# Altium project STM32F7 Dev.PrjPcb (part 2 of 2)

## Sheet Sheet3.SchDoc
size Legal
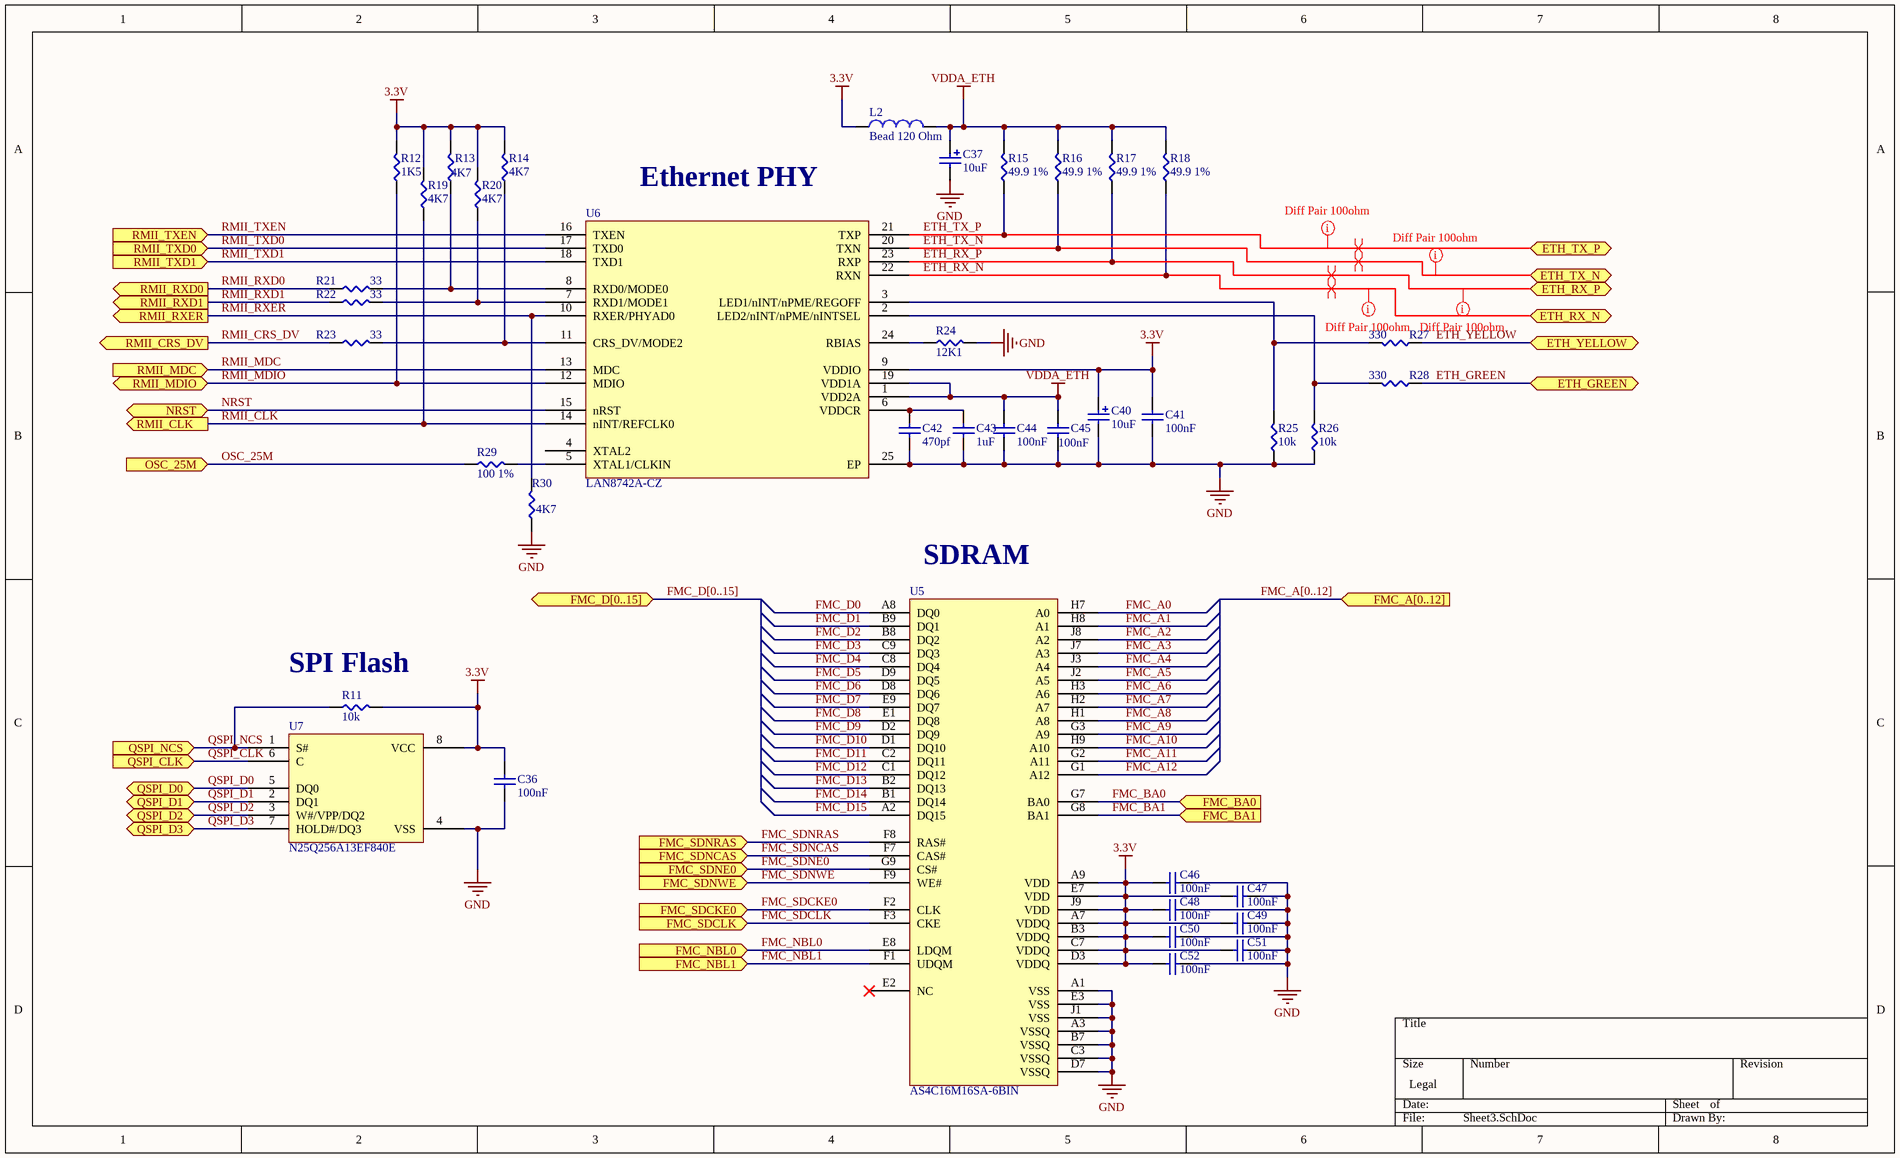
[diagram p2: Sheet3.SchDoc]

### Parts
C36  100nF  [CAP0402X04M]
C37  10uF  [CAPPOL1206X07M]
C40  10uF  [CAPPOL1206X07M]
C41  100nF  [CAP0402X04M]
C42  470pf  [CAP0402X04M]
C43  1uF  [CAP0402X04M]
C44  100nF  [CAP0402X04M]
C45  100nF  [CAP0402X04M]
C46  100nF  [CAP0402X04M]
C47  100nF  [CAP0402X04M]
C48  100nF  [CAP0402X04ROUND]
C49  100nF  [CAP0402X04ROUND]
C50  100nF  [CAP0402X04ROUND]
C51  100nF  [CAP0402X04ROUND]
C52  100nF  [CAP0402X04ROUND]
L2  Bead 120 Ohm  [IND0603X055M]
R11  10k  [RES0402X04M]
R12  1K5  [RES0402X04M]
R13  4K7  [RES0402X04M]
R14  4K7  [RES0402X04M]
R15  49.9 1%  [RES0402X04M]
R16  49.9 1%  [RES0402X04M]
R17  49.9 1%  [RES0402X04M]
R18  49.9 1%  [RES0402X04M]
R19  4K7  [RES0402X04M]
R20  4K7  [RES0402X04M]
R21  33  [RES0402X04M]
R22  33  [RES0402X04M]
R23  33  [RES0402X04M]
R24  12K1  [RES0402X04M]
R25  10k  [RES0402X04M]
R26  10k  [RES0402X04M]
R27  330  [RES0402X04M]
R28  330  [RES0402X04M]
R29  100 1%  [RES0402X04M]
R30  4K7  [RES0402X04M]
U5  AS4C16M16SA-6BIN  [BGA100P9X9-54A]
U6  LAN8742A-CZ  [QFN50P400X400X100_HS-25N]
U7  N25Q256A13EF840E  [SON127P800X100_HS-9N]

### Ports
ETH_GREEN (bidir), ETH_RX_N (bidir), ETH_RX_P (bidir), ETH_TX_N (bidir), ETH_TX_P (bidir), ETH_YELLOW (bidir), FMC_A[0..12] (in), FMC_BA0 (in), FMC_BA1 (in), FMC_D[0..15] (bidir), FMC_NBL0 (in), FMC_NBL1 (in), FMC_SDCKE0 (in), FMC_SDCLK (in), FMC_SDNCAS (in), FMC_SDNE0 (in), FMC_SDNRAS (in), FMC_SDNWE (in), NRST (bidir), OSC_25M (in), QSPI_CLK (in), QSPI_D0 (bidir), QSPI_D1 (bidir), QSPI_D2 (bidir), QSPI_D3 (bidir), QSPI_NCS (in), RMII_CLK (out), RMII_CRS_DV (out), RMII_MDC (in), RMII_MDIO (bidir), RMII_RXD0 (out), RMII_RXD1 (out), RMII_RXER (out), RMII_TXD0 (in), RMII_TXD1 (in), RMII_TXEN (in)

### Nets
3.3V: C36.2 C40.1 C41.2 C46.1 C47.1 C48.1 C49.1 C50.1 C51.1 C52.1 L2.1 R11.2 R12.2 R13.2 R14.2 R19.2 R20.2 U5.A7(VDDQ) U5.A9(VDD) U5.B3(VDDQ) U5.C7(VDDQ) U5.D3(VDDQ) U5.E7(VDD) U5.J9(VDD) U6.9(VDDIO) U7.8(VCC)
GND: C36.1 C37.2 C40.2 C41.1 C42.1 C43.1 C44.1 C45.1 C46.2 C47.2 C48.2 C49.2 C50.2 C51.2 C52.2 R24.2 R25.1 R26.1 R30.1 U5.A1(VSS) U5.A3(VSSQ) U5.B7(VSSQ) U5.C3(VSSQ) U5.D7(VSSQ) U5.E3(VSS) U5.J1(VSS) U6.25(EP) U7.4(VSS)
VDDA_ETH: C37.1 C44.2 C45.2 L2.2 R15.2 R16.2 R17.2 R18.2 U6.1(VDD2A) U6.19(VDD1A)
ETH_GREEN: R28.1 ; port ETH_GREEN
ETH_RX_N: R18.1 U6.22(RXN) ; port ETH_RX_N
ETH_RX_P: R17.1 U6.23(RXP) ; port ETH_RX_P
ETH_TX_N: R16.1 U6.20(TXN) ; port ETH_TX_N
ETH_TX_P: R15.1 U6.21(TXP) ; port ETH_TX_P
ETH_YELLOW: R27.1 ; port ETH_YELLOW
FMC_A0: U5.H7(A0)
FMC_A1: U5.H8(A1)
FMC_A2: U5.J8(A2)
FMC_A3: U5.J7(A3)
FMC_A4: U5.J3(A4)
FMC_A5: U5.J2(A5)
FMC_A6: U5.H3(A6)
FMC_A7: U5.H2(A7)
FMC_A8: U5.H1(A8)
FMC_A9: U5.G3(A9)
FMC_A10: U5.H9(A10)
FMC_A11: U5.G2(A11)
FMC_A12: U5.G1(A12)
FMC_BA0: U5.G7(BA0) ; port FMC_BA0
FMC_BA1: U5.G8(BA1) ; port FMC_BA1
FMC_D0: U5.A8(DQ0)
FMC_D1: U5.B9(DQ1)
FMC_D2: U5.B8(DQ2)
FMC_D3: U5.C9(DQ3)
FMC_D4: U5.C8(DQ4)
FMC_D5: U5.D9(DQ5)
FMC_D6: U5.D8(DQ6)
FMC_D7: U5.E9(DQ7)
FMC_D8: U5.E1(DQ8)
FMC_D9: U5.D2(DQ9)
FMC_D10: U5.D1(DQ10)
FMC_D11: U5.C2(DQ11)
FMC_D12: U5.C1(DQ12)
FMC_D13: U5.B2(DQ13)
FMC_D14: U5.B1(DQ14)
FMC_D15: U5.A2(DQ15)
FMC_NBL0: U5.E8(LDQM) ; port FMC_NBL0
FMC_NBL1: U5.F1(UDQM) ; port FMC_NBL1
FMC_SDCKE0: U5.F2(CLK) ; port FMC_SDCKE0
FMC_SDCLK: U5.F3(CKE) ; port FMC_SDCLK
FMC_SDNCAS: U5.F7(CAS#) ; port FMC_SDNCAS
FMC_SDNE0: U5.G9(CS#) ; port FMC_SDNE0
FMC_SDNRAS: U5.F8(RAS#) ; port FMC_SDNRAS
FMC_SDNWE: U5.F9(WE#) ; port FMC_SDNWE
NRST: U6.15(nRST) ; port NRST
OSC_25M: R29.1 ; port OSC_25M
QSPI_CLK: U7.6(C) ; port QSPI_CLK
QSPI_D0: U7.5(DQ0) ; port QSPI_D0
QSPI_D1: U7.2(DQ1) ; port QSPI_D1
QSPI_D2: U7.3(W#/VPP/DQ2) ; port QSPI_D2
QSPI_D3: U7.7(HOLD#/DQ3) ; port QSPI_D3
QSPI_NCS: R11.1 U7.1(S#) ; port QSPI_NCS
RMII_CLK: R19.1 U6.14(nINT/REFCLK0) ; port RMII_CLK
RMII_CRS_DV: R23.1 ; port RMII_CRS_DV
RMII_MDC: U6.13(MDC) ; port RMII_MDC
RMII_MDIO: R12.1 U6.12(MDIO) ; port RMII_MDIO
RMII_RXD0: R21.1 ; port RMII_RXD0
RMII_RXD1: R22.1 ; port RMII_RXD1
RMII_RXER: R30.2 U6.10(RXER/PHYAD0) ; port RMII_RXER
RMII_TXD0: U6.17(TXD0) ; port RMII_TXD0
RMII_TXD1: U6.18(TXD1) ; port RMII_TXD1
RMII_TXEN: U6.16(TXEN) ; port RMII_TXEN
NetC42_2: C42.2 C43.2 U6.6(VDDCR)
NetR13_1: R13.1 R21.2 U6.8(RXD0/MODE0)
NetR14_1: R14.1 R23.2 U6.11(CRS_DV/MODE2)
NetR20_1: R20.1 R22.2 U6.7(RXD1/MODE1)
NetR24_1: R24.1 U6.24(RBIAS)
NetR25_2: R25.2 R27.2 U6.3(LED1/nINT/nPME/REGOFF)
NetR26_2: R26.2 R28.2 U6.2(LED2/nINT/nPME/nINTSEL)
NetR29_2: R29.2 U6.5(XTAL1/CLKIN)

Not connected (* = marked no-connect by the designer): U5 E2(NC)*; U6 4(XTAL2)

### Buses and harness runs
bus FMC_A[0..12] = port FMC_A[0..12]
bus FMC_D[0..15] = port FMC_D[0..15]

### Layout directives
differential pair: ETH_RX_N, ETH_RX_P, ETH_TX_N, ETH_TX_P
DiffPair100: Undefined: ETH_RX_N, ETH_RX_P, ETH_TX_N, ETH_TX_P

### Notes on the sheet
- (near U6) Ethernet PHY
- (near U5) SDRAM
- (near R11) SPI Flash

### Library data of the parts
C36 C41 C44-C52 = GRM155R71C104KA88J: CAP CER 0.1UF 16V X7R 0402; Manufacturer: Murata Electronics North America; Capacitance: 0.10µF; Tolerance: ±10%; Supplier 1: Digi-Key; Manufacturer Part Number: GRM155R71C104KA88J; RoHS: RoHS Compliant; Category: Capacitors; Stock 1: 28696221; Pricing 1: 1=0.1, 10=0.012, 50=0.0066, 100=0.0055, 250=0.00452, 500=0.00386, 1000=0.003, 5000=0.0025, 10000=0.0023 (USD); Packaging: Cut Tape (CT); Part Status: Active; Voltage - Rated: 16V; Temperature Coefficient: X7R; Operating Temperature: -55°C ~ 125°C; Features: -; Ratings: -; Applications: General Purpose; Failure Rate: *; Mounting Type: Surface Mount, MLCC; Package / Case: 0402 (1005 Metric); Size / Dimension: 0.039" L x 0.020" W (1.00mm x 0.50mm); Height - Seated (Max): -; Thickness (Max): 0.022" (0.55mm); Lead Spacing: -; Lead Style: *; ComponentLink1URL: http://www.murata.com/~/media/webrenewal/support/library/catalog/products/capacitor/mlcc/c02e.pdf; ComponentLink1Description: http://www.murata.com/~/media/webrenewal/support/library/catalog/products/capacitor/mlcc/c02e.pdf; Supplier Part Number 1: 490-6328-1-ND
C37 C40 = 293D106X9010A2TE3: CAP TANT 10UF 10V 10% 1206; Manufacturer: Vishay Sprague; Manufacturer Size Code: A; Capacitance: 10µF; Type: Molded; ESR (Equivalent Series Resistance): 3.4 Ohm; Supplier 1: Digi-Key; Manufacturer Part Number: 293D106X9010A2TE3; RoHS: RoHS Compliant; Category: Capacitors; Stock 1: 36334; Pricing 1: 1=0.44, 10=0.314, 25=0.268, 50=0.2374, 100=0.2068, 250=0.1762, 500=0.15322, 1000=0.13024 (USD); Packaging: Cut Tape (CT); Part Status: Active; Tolerance: ±10%; Voltage - Rated: 10V; Operating Temperature: -55°C ~ 125°C; Lifetime @ Temp.: -; Mounting Type: Surface Mount; Package / Case: 1206 (3216 Metric); Size / Dimension: 0.126" L x 0.063" W (3.20mm x 1.60mm); Height - Seated (Max): 0.071" (1.80mm); Lead Spacing: -; Features: General Purpose; Failure Rate: -; ComponentLink1URL: http://www.vishay.com/docs/40002/293d.pdf; ComponentLink1Description: http://www.vishay.com/docs/40002/293d.pdf; Supplier Part Number 1: 718-1121-1-ND
C42 = CL05B471KB5NNNC: CAP CER 470PF 50V X7R 0402; Manufacturer: Samsung Electro-Mechanics America, Inc.; Tolerance: ±10%; Supplier 1: Digi-Key; Manufacturer Part Number: CL05B471KB5NNNC; RoHS: RoHS Compliant; Category: Capacitors; Stock 1: 310584; Pricing 1: 1=0.1, 10=0.01, 25=0.006, 50=0.0044, 100=0.0036, 250=0.00304, 500=0.0026, 1000=0.00204, 5000=0.0017 (USD); Packaging: Cut Tape (CT); Part Status: Active; Capacitance: 470pF; Voltage - Rated: 50V; Temperature Coefficient: X7R; Operating Temperature: -55°C ~ 125°C; Features: -; Ratings: -; Applications: General Purpose; Mounting Type: Surface Mount, MLCC; Package / Case: 0402 (1005 Metric); Size / Dimension: 0.039" L x 0.020" W (1.00mm x 0.50mm); Height - Seated (Max): -; Thickness (Max): 0.022" (0.55mm); Lead Spacing: -; Lead Style: -; ComponentLink1URL: http://www.samsungsem.com/kr/support/product-search/mlcc/__icsFiles/afieldfile/2016/08/18/S_CL05B471KB5NNNC.pdf; ComponentLink1Description: http://www.samsungsem.com/kr/support/product-search/mlcc/__icsFiles/afieldfile/2016/08/18/S_CL05B471KB5NNNC.pdf; Supplier Part Number 1: 1276-1566-1-ND
C43 = GRM155R60J105KE19D: CAP CER 1UF 6.3V X5R 0402; Manufacturer: Murata Electronics North America; Capacitance: 1µF; Tolerance: ±10%; Supplier 1: Digi-Key; Manufacturer Part Number: GRM155R60J105KE19D; RoHS: RoHS Compliant; Category: Capacitors; Stock 1: 3970482; Pricing 1: 1=0.1, 10=0.021, 50=0.0114, 100=0.0096, 250=0.00784, 500=0.0067, 1000=0.00522, 5000=0.00435 (USD); Packaging: Cut Tape (CT); Part Status: Active; Voltage - Rated: 6.3V; Temperature Coefficient: X5R; Operating Temperature: -55°C ~ 85°C; Features: -; Ratings: -; Applications: General Purpose; Failure Rate: *; Mounting Type: Surface Mount, MLCC; Package / Case: 0402 (1005 Metric); Size / Dimension: 0.039" L x 0.020" W (1.00mm x 0.50mm); Height - Seated (Max): -; Thickness (Max): 0.022" (0.55mm); Lead Spacing: -; Lead Style: -; ComponentLink1URL: http://www.murata.com/~/media/webrenewal/support/library/catalog/products/capacitor/mlcc/c02e.pdf; ComponentLink1Description: http://www.murata.com/~/media/webrenewal/support/library/catalog/products/capacitor/mlcc/c02e.pdf; Supplier Part Number 1: 490-1320-1-ND
L2 = BLM18PG121SN1D: FERRITE BEAD 120 OHM 0603 1LN; Manufacturer: Murata Electronics North America; Filter Type: Power Line; Number of Lines: 1; Impedance @ Frequency: 120 Ohm @ 100MHz; Current Rating (Max): 2A; DC Resistance (DCR) (Max): 50 mOhm; Supplier 1: Digi-Key; Manufacturer Part Number: BLM18PG121SN1D; RoHS: RoHS Compliant; Category: Filters; Stock 1: 815704; Pricing 1: 1=0.1, 10=0.083, 50=0.0684, 100=0.0501, 250=0.03644, 500=0.0334, 1000=0.02884 (USD); Packaging: Cut Tape (CT); Part Status: Active; Ratings: -; Operating Temperature: -55°C ~ 125°C; Package / Case: 0603 (1608 Metric); Mounting Type: Surface Mount; Height (Max): 0.037" (0.95mm); Size / Dimension: 0.063" L x 0.031" W (1.60mm x 0.80mm); ComponentLink1URL: http://search.murata.co.jp/Ceramy/image/img/PDF/ENG/L0110S0100BLM18P.pdf; ComponentLink1Description: http://search.murata.co.jp/Ceramy/image/img/PDF/ENG/L0110S0100BLM18P.pdf; Supplier Part Number 1: 490-1037-1-ND
R11 R25 R26 = RC0402FR-0710KL: RES SMD 10K OHM 1% 1/16W 0402; Manufacturer: Yageo; Power (Watts): 0.063W, 1/16W; Temperature Coefficient: ±100ppm/°C; Supplier 1: Digi-Key; Manufacturer Part Number: RC0402FR-0710KL; RoHS: RoHS Compliant; Category: Resistors; Stock 1: 13115833; Pricing 1: 1=0.1, 10=0.013, 25=0.0096, 100=0.0054, 250=0.00412, 500=0.00328, 1000=0.00242, 2500=0.0021, 5000=0.00173 (USD); Packaging: Cut Tape (CT); Part Status: Active; Resistance (Ohms): 10k; Tolerance: ±1%; Composition: Thick Film; Features: Moisture Resistant; Operating Temperature: -55°C ~ 155°C; Package / Case: 0402 (1005 Metric); Supplier Device Package: 0402; Size / Dimension: 0.039" L x 0.020" W (1.00mm x 0.50mm); Height - Seated (Max): 0.016" (0.40mm); Number of Terminations: 2; Failure Rate: -; ComponentLink1URL: http://www.yageo.com/NewPortal/yageodocoutput?fileName=/pdf/R-Chip/PYu-RC_Group_51_RoHS_L_4.pdf; ComponentLink1Description: http://www.yageo.com/NewPortal/yageodocoutput?fileName=/pdf/R-Chip/PYu-RC_Group_51_RoHS_L_4.pdf; Supplier Part Number 1: 311-10.0KLRCT-ND
R12 = ERJ-2RKF1501X: RES SMD 1.5K OHM 1% 1/10W 0402; Manufacturer: Panasonic Electronic Components; Power (Watts): 0.1W, 1/10W; Temperature Coefficient: ±100ppm/°C; Supplier 1: Digi-Key; Manufacturer Part Number: ERJ-2RKF1501X; RoHS: RoHS Compliant; Category: Resistors; Stock 1: 495191; Pricing 1: 1=0.1, 50=0.015, 100=0.011, 250=0.0084, 500=0.00674, 1000=0.00496, 5000=0.00355 (USD); Packaging: Cut Tape (CT); Part Status: Active; Resistance (Ohms): 1.5k; Tolerance: ±1%; Composition: Thick Film; Features: Automotive AEC-Q200; Operating Temperature: -55°C ~ 155°C; Package / Case: 0402 (1005 Metric); Supplier Device Package: 0402; Size / Dimension: 0.039" L x 0.020" W (1.00mm x 0.50mm); Height - Seated (Max): 0.016" (0.40mm); Number of Terminations: 2; Failure Rate: -; ComponentLink1URL: http://industrial.panasonic.com/www-cgi/jvcr13pz.cgi?E+PZ+3+AOA0002+ERJ2RKF1501X+7+WW; ComponentLink1Description: http://industrial.panasonic.com/www-cgi/jvcr13pz.cgi?E+PZ+3+AOA0002+ERJ2RKF1501X+7+WW; Supplier Part Number 1: P1.50KLCT-ND
R13 R14 R19 R20 R30 = ERJ-2RKF4701X: RES SMD 4.7K OHM 1% 1/10W 0402; Manufacturer: Panasonic Electronic Components; Power (Watts): 0.1W, 1/10W; Temperature Coefficient: ±100ppm/°C; Supplier 1: Digi-Key; Manufacturer Part Number: ERJ-2RKF4701X; RoHS: RoHS Compliant; Category: Resistors; Stock 1: 2071334; Pricing 1: 1=0.1, 50=0.015, 100=0.011, 250=0.0084, 500=0.00674, 1000=0.00496, 5000=0.00355 (USD); Packaging: Cut Tape (CT); Part Status: Active; Resistance (Ohms): 4.7k; Tolerance: ±1%; Composition: Thick Film; Features: Automotive AEC-Q200; Operating Temperature: -55°C ~ 155°C; Package / Case: 0402 (1005 Metric); Supplier Device Package: 0402; Size / Dimension: 0.039" L x 0.020" W (1.00mm x 0.50mm); Height - Seated (Max): 0.016" (0.40mm); Number of Terminations: 2; Failure Rate: -; ComponentLink1URL: http://industrial.panasonic.com/www-cgi/jvcr13pz.cgi?E+PZ+3+AOA0002+ERJ2RKF4701X+7+WW; ComponentLink1Description: http://industrial.panasonic.com/www-cgi/jvcr13pz.cgi?E+PZ+3+AOA0002+ERJ2RKF4701X+7+WW; Supplier Part Number 1: P4.70KLCT-ND
R15-R18 = RC0402FR-0749R9L: RES SMD 49.9 OHM 1% 1/16W 0402; Manufacturer: Yageo; Resistance (Ohms): 49.9; Power (Watts): 0.063W, 1/16W; Temperature Coefficient: ±100ppm/°C; Supplier 1: Digi-Key; Manufacturer Part Number: RC0402FR-0749R9L; RoHS: RoHS Compliant; Category: Resistors; Stock 1: 3988356; Pricing 1: 1=0.1, 10=0.012, 25=0.0088, 50=0.0066, 100=0.0049, 250=0.00372, 500=0.00298, 1000=0.0022, 5000=0.00158 (USD); Packaging: Cut Tape (CT); Part Status: Active; Tolerance: ±1%; Composition: Thick Film; Features: Moisture Resistant; Operating Temperature: -55°C ~ 155°C; Package / Case: 0402 (1005 Metric); Supplier Device Package: 0402; Size / Dimension: 0.039" L x 0.020" W (1.00mm x 0.50mm); Height - Seated (Max): 0.016" (0.40mm); Number of Terminations: 2; Failure Rate: -; ComponentLink1URL: http://www.yageo.com/NewPortal/yageodocoutput?fileName=/pdf/R-Chip/PYu-RC_Group_51_RoHS_L_4.pdf; ComponentLink1Description: http://www.yageo.com/NewPortal/yageodocoutput?fileName=/pdf/R-Chip/PYu-RC_Group_51_RoHS_L_4.pdf; Supplier Part Number 1: 311-49.9LRCT-ND
R21-R23 = ERJ-2RKF33R0X: RES SMD 33 OHM 1% 1/10W 0402; Manufacturer: Panasonic Electronic Components; Power (Watts): 0.1W, 1/10W; Temperature Coefficient: ±100ppm/°C; Supplier 1: Digi-Key; Manufacturer Part Number: ERJ-2RKF33R0X; RoHS: RoHS Compliant; Category: Resistors; Stock 1: 551621; Pricing 1: 1=0.1, 50=0.015, 100=0.011, 250=0.0084, 500=0.00674, 1000=0.00496, 5000=0.00355 (USD); Packaging: Cut Tape (CT); Part Status: Active; Resistance (Ohms): 33; Tolerance: ±1%; Composition: Thick Film; Features: Automotive AEC-Q200; Operating Temperature: -55°C ~ 155°C; Package / Case: 0402 (1005 Metric); Supplier Device Package: 0402; Size / Dimension: 0.039" L x 0.020" W (1.00mm x 0.50mm); Height - Seated (Max): 0.016" (0.40mm); Number of Terminations: 2; Failure Rate: -; ComponentLink1URL: http://industrial.panasonic.com/www-cgi/jvcr13pz.cgi?E+PZ+3+AOA0002+ERJ2RKF33R0X+7+WW; ComponentLink1Description: http://industrial.panasonic.com/www-cgi/jvcr13pz.cgi?E+PZ+3+AOA0002+ERJ2RKF33R0X+7+WW; Supplier Part Number 1: P33.0LCT-ND
R24 = ERJ-2RKF1212X: RES SMD 12.1K OHM 1% 1/10W 0402; Manufacturer: Panasonic Electronic Components; Power (Watts): 0.1W, 1/10W; Temperature Coefficient: ±100ppm/°C; Supplier 1: Digi-Key; Manufacturer Part Number: ERJ-2RKF1212X; RoHS: RoHS Compliant; Category: Resistors; Stock 1: 177460; Pricing 1: 1=0.1, 50=0.015, 100=0.011, 250=0.0084, 500=0.00674, 1000=0.00496, 5000=0.00355 (USD); Packaging: Cut Tape (CT); Part Status: Active; Resistance (Ohms): 12.1k; Tolerance: ±1%; Composition: Thick Film; Features: Automotive AEC-Q200; Operating Temperature: -55°C ~ 155°C; Package / Case: 0402 (1005 Metric); Supplier Device Package: 0402; Size / Dimension: 0.039" L x 0.020" W (1.00mm x 0.50mm); Height - Seated (Max): 0.016" (0.40mm); Number of Terminations: 2; Failure Rate: -; ComponentLink1URL: http://industrial.panasonic.com/www-cgi/jvcr13pz.cgi?E+PZ+3+AOA0002+ERJ2RKF1212X+7+WW; ComponentLink1Description: http://industrial.panasonic.com/www-cgi/jvcr13pz.cgi?E+PZ+3+AOA0002+ERJ2RKF1212X+7+WW; Supplier Part Number 1: P12.1KLCT-ND
R27 R28 = ERJ-2RKF3300X: RES SMD 330 OHM 1% 1/10W 0402; Manufacturer: Panasonic Electronic Components; Power (Watts): 0.1W, 1/10W; Temperature Coefficient: ±100ppm/°C; Supplier 1: Digi-Key; Manufacturer Part Number: ERJ-2RKF3300X; RoHS: RoHS Compliant; Category: Resistors; Stock 1: 549213; Pricing 1: 1=0.1, 50=0.015, 100=0.011, 250=0.0084, 500=0.00674, 1000=0.00496, 5000=0.00355 (USD); Packaging: Cut Tape (CT); Part Status: Active; Resistance (Ohms): 330; Tolerance: ±1%; Composition: Thick Film; Features: Automotive AEC-Q200; Operating Temperature: -55°C ~ 155°C; Package / Case: 0402 (1005 Metric); Supplier Device Package: 0402; Size / Dimension: 0.039" L x 0.020" W (1.00mm x 0.50mm); Height - Seated (Max): 0.016" (0.40mm); Number of Terminations: 2; Failure Rate: -; ComponentLink1URL: http://industrial.panasonic.com/www-cgi/jvcr13pz.cgi?E+PZ+3+AOA0002+ERJ2RKF3300X+7+WW; ComponentLink1Description: http://industrial.panasonic.com/www-cgi/jvcr13pz.cgi?E+PZ+3+AOA0002+ERJ2RKF3300X+7+WW; Supplier Part Number 1: P330LCT-ND
R29 = RC0402FR-07100RL: RES SMD 100 OHM 1% 1/16W 0402; Manufacturer: Yageo; Resistance (Ohms): 100; Power (Watts): 0.063W, 1/16W; Temperature Coefficient: ±100ppm/°C; Supplier 1: Digi-Key; Manufacturer Part Number: RC0402FR-07100RL; RoHS: RoHS Compliant; Category: Resistors; Stock 1: 4498031; Pricing 1: 1=0.1, 10=0.013, 25=0.0096, 100=0.0054, 250=0.00412, 500=0.00328, 1000=0.00242, 2500=0.0021, 5000=0.00173 (USD); Packaging: Cut Tape (CT); Part Status: Active; Tolerance: ±1%; Composition: Thick Film; Features: Moisture Resistant; Operating Temperature: -55°C ~ 155°C; Package / Case: 0402 (1005 Metric); Supplier Device Package: 0402; Size / Dimension: 0.039" L x 0.020" W (1.00mm x 0.50mm); Height - Seated (Max): 0.016" (0.40mm); Number of Terminations: 2; Failure Rate: -; ComponentLink1URL: http://www.yageo.com/NewPortal/yageodocoutput?fileName=/pdf/R-Chip/PYu-RC_Group_51_RoHS_L_4.pdf; ComponentLink1Description: http://www.yageo.com/NewPortal/yageodocoutput?fileName=/pdf/R-Chip/PYu-RC_Group_51_RoHS_L_4.pdf; Supplier Part Number 1: 311-100LRCT-ND
U5 = AS4C16M16SA-6BIN: IC SDRAM 256MBIT 166MHZ 54BGA; Manufacturer: Alliance Memory, Inc.; Format - Memory: RAM; Memory Type: SDRAM (Synchronous DRAM); Memory Size: 256M (16M x 16); Interface: Parallel; Voltage - Supply: 3 V ~ 3.6 V; Supplier 1: Digi-Key; Manufacturer Part Number: AS4C16M16SA-6BIN; RoHS: RoHS Compliant; Category: Integrated Circuits (ICs); Stock 1: 1203; Pricing 1: 1=4.87, 10=4.423, 25=4.3272, 50=4.3032, 100=3.8592, 250=3.8448 (USD); Packaging: Tray; Part Status: Active; Speed: 166MHz; Operating Temperature: -40°C ~ 85°C (TA); Package / Case: 54-TFBGA; Supplier Device Package: 54-TFBGA (8x8); ComponentLink1URL: http://www.alliancememory.com/pdf/dram/256Mb-AS4C16M16SA-C&I_V3.0_March%202015.pdf; ComponentLink1Description: http://www.alliancememory.com/pdf/dram/256Mb-AS4C16M16SA-C&I_V3.0_March%202015.pdf; Supplier Part Number 1: 1450-1250-ND
U6 = LAN8742A-CZ: IC TXRX ETHERNET 100MBPS 24QFN; Manufacturer: Microchip Technology; Number of Drivers/Receivers: 1/1; Voltage - Supply: 1.6 V ~ 3.6 V; Supplier 1: Digi-Key; Manufacturer Part Number: LAN8742A-CZ; RoHS: RoHS Compliant; Category: Integrated Circuits (ICs); Stock 1: 1766; Pricing 1: 1=1.24, 25=1.03, 100=0.9373 (USD); Packaging: Tray; Part Status: Active; Type: Transceiver; Protocol: Ethernet; Duplex: -; Receiver Hysteresis: -; Data Rate: 100Mbps; Operating Temperature: 0°C ~ 85°C; Mounting Type: Surface Mount; Package / Case: 24-VFQFN Exposed Pad; Supplier Device Package: 24-SQFN (4x4); ComponentLink1URL: http://www.microchip.com/mymicrochip/filehandler.aspx?ddocname=en566967; ComponentLink1Description: http://www.microchip.com/mymicrochip/filehandler.aspx?ddocname=en566967; Supplier Part Number 1: LAN8742A-CZ-ND
U7 = N25Q256A13EF840E: IC FLASH 256MBIT 108MHZ 8VPDFN; Manufacturer: Micron Technology Inc.; Memory Type: FLASH - NOR; Memory Size: 256M (64Mx4); Interface: SPI Serial; Voltage - Supply: 2.7 V ~ 3.6 V; Supplier 1: Digi-Key; Manufacturer Part Number: N25Q256A13EF840E; RoHS: RoHS Compliant; Category: Integrated Circuits (ICs); Stock 1: 10311; Pricing 1: 1=2.74, 10=2.464, 25=2.4244, 50=2.418, 100=2.1606, 250=2.0904, 500=2.0826, 1000=1.9396, 5000=1.755 (USD); Packaging: Tray; Part Status: Active; Format - Memory: FLASH; Speed: 108MHz; Operating Temperature: -40°C ~ 85°C (TA); Package / Case: 8-VDFN Exposed Pad; Supplier Device Package: 8-VDFPN (MLP8) (8x6); ComponentLink1URL: https://www.micron.com/~/media/documents/products/data-sheet/nor-flash/serial-nor/n25q/n25q_256mb_3v.pdf; ComponentLink1Description: https://www.micron.com/~/media/documents/products/data-sheet/nor-flash/serial-nor/n25q/n25q_256mb_3v.pdf; Supplier Part Number 1: 557-1565-ND

## Nets that join several sheets
3.3V: Sheet1 (56 pins), Sheet2 (5 pins), Sheet3 (26 pins)
GND: Sheet1 (66 pins), Sheet2 (5 pins), Sheet3 (28 pins)
BOOT0: Sheet1 (J1.10), Sheet2 (U1.E6)
Button: Sheet1 (J1.13), Sheet2 (U1.F3)
ETH_GREEN: Sheet1 (J1.96), Sheet3 (R28.1)
ETH_RX_N: Sheet1 (J1.48), Sheet3 (R18.1 U6.22)
ETH_RX_P: Sheet1 (J1.47), Sheet3 (R17.1 U6.23)
ETH_TX_N: Sheet1 (J1.98), Sheet3 (R16.1 U6.20)
ETH_TX_P: Sheet1 (J1.97), Sheet3 (R15.1 U6.21)
ETH_YELLOW: Sheet1 (J1.46), Sheet3 (R27.1)
FMC_BA0: Sheet2 (U1.N12), Sheet3 (U5.G7)
FMC_BA1: Sheet2 (U1.N11), Sheet3 (U5.G8)
FMC_NBL0: Sheet2 (U1.A6), Sheet3 (U5.E8)
FMC_NBL1: Sheet2 (U1.A5), Sheet3 (U5.F1)
FMC_SDCKE0: Sheet2 (U1.L4), Sheet3 (U5.F2)
FMC_SDCLK: Sheet2 (U1.H14), Sheet3 (U5.F3)
FMC_SDNCAS: Sheet2 (U1.B7), Sheet3 (U5.F7)
FMC_SDNE0: Sheet2 (U1.J4), Sheet3 (U5.G9)
FMC_SDNRAS: Sheet2 (U1.P8), Sheet3 (U5.F8)
FMC_SDNWE: Sheet2 (U1.J3), Sheet3 (U5.F9)
NRST: Sheet1 (J1.60), Sheet2 (R5.1 U1.J1), Sheet3 (U6.15)
OSC_25M: Sheet2 (U1.G1 X1.3), Sheet3 (R29.1)
OTG_ID: Sheet1 (J1.59 U4.A3), Sheet2 (U1.D15)
OTG_N: Sheet1 (J1.58 U4.D1 U4.D3), Sheet2 (U1.C15)
OTG_P: Sheet1 (J1.57 U4.C1 U4.C3), Sheet2 (U1.B15)
OTG_PWR_EN: Sheet1 (R2.1 U2.4), Sheet2 (U1.C10)
OTG_PWR_FAULT: Sheet1 (R1.1 U2.3), Sheet2 (U1.D11)
OTG_VBUS: Sheet1 (J1.55 J1.56 U4.B3), Sheet2 (R10.1)
QSPI_CLK: Sheet2 (U1.M5), Sheet3 (U7.6)
QSPI_D0: Sheet2 (U1.N10), Sheet3 (U7.5)
QSPI_D1: Sheet2 (U1.M10), Sheet3 (U7.2)
QSPI_D2: Sheet2 (U1.A3), Sheet3 (U7.3)
QSPI_D3: Sheet2 (U1.M11), Sheet3 (U7.7)
QSPI_NCS: Sheet2 (U1.B6), Sheet3 (R11.1 U7.1)
RMII_CLK: Sheet2 (U1.N2), Sheet3 (R19.1 U6.14)
RMII_CRS_DV: Sheet2 (U1.R3), Sheet3 (R23.1)
RMII_MDC: Sheet2 (U1.M3), Sheet3 (U6.13)
RMII_MDIO: Sheet2 (U1.P2), Sheet3 (R12.1 U6.12)
RMII_RXD0: Sheet2 (U1.N5), Sheet3 (R21.1)
RMII_RXD1: Sheet2 (U1.P5), Sheet3 (R22.1)
RMII_RXER: Sheet2 (U1.J15), Sheet3 (R30.2 U6.10)
RMII_TXD0: Sheet2 (U1.B3), Sheet3 (U6.17)
RMII_TXD1: Sheet2 (U1.A4), Sheet3 (U6.18)
RMII_TXEN: Sheet2 (U1.B8), Sheet3 (U6.16)
SCL: Sheet1 (J1.15 R35.1), Sheet2 (U1.A7)
SDA: Sheet1 (J1.14 R34.1), Sheet2 (U1.B4)
SWDCLK: Sheet1 (J1.61), Sheet2 (U1.A14)
SWDIO: Sheet1 (J1.11), Sheet2 (U1.A15)
SWO: Sheet1 (J1.12), Sheet2 (U1.A10)
uSD_CLK: Sheet1 (J1.66), Sheet2 (U1.A12)
uSD_D0: Sheet1 (J1.62 R7.1), Sheet2 (U1.G14)
uSD_D1: Sheet1 (J1.63 R8.1), Sheet2 (U1.F14)
uSD_D2: Sheet1 (J1.64 R31.1), Sheet2 (U1.B14)
uSD_D3: Sheet1 (J1.65 R32.1), Sheet2 (U1.B13)
uSD_Detect: Sheet1 (J1.67 R33.1), Sheet2 (U1.D1)